# EAGLE design extension.board.v3 (EAGLE 9.0.1)
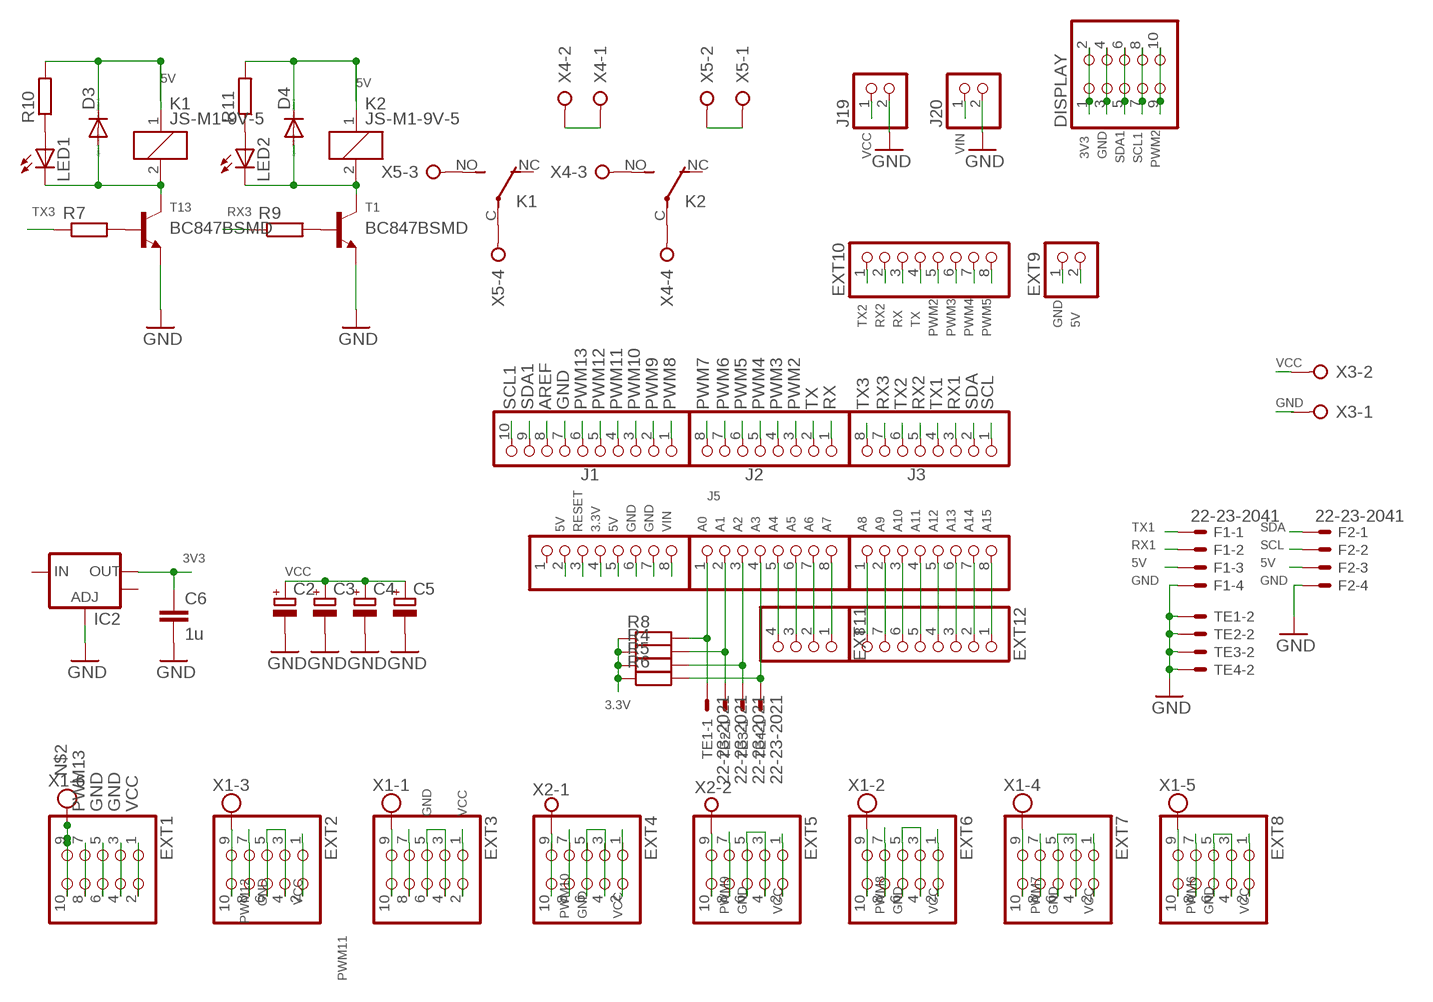
[diagram p0: schematic, sheet 1]

## Parts
C2  CPOL-EUE2.5-7  [E2,5-7]
C3  CPOL-EUE2.5-7  [E2,5-7]
C4  CPOL-EUE2.5-7  [E2,5-7]
C5  CPOL-EUE2.5-7  [E2,5-7]
C6  1u  C-EUC0805  [C0805]
D3  DIODE-DO-214AC  [DO-214AC]
D4  DIODE-DO-214AC  [DO-214AC]
DISPLAY  PINHD-2X5  [2X05]
EXT1  PINHD-2X5  [2X05]
EXT2  PINHD-2X5  [2X05]
EXT3  PINHD-2X5  [2X05]
EXT4  PINHD-2X5  [2X05]
EXT5  PINHD-2X5  [2X05]
EXT6  PINHD-2X5  [2X05]
EXT7  PINHD-2X5  [2X05]
EXT8  PINHD-2X5  [2X05]
EXT9  PINHD-1X2  [1X02]
EXT10  PINHD-1X8  [1X08]
EXT11  PINHD-1X4  [1X04]
EXT12  PINHD-1X8  [1X08]
F1  22-23-2041  [22-23-2041]
F2  22-23-2041  [22-23-2041]
IC2  V_REG_LM1117SOT223  [SOT223]
J1  PINHD-1X10  [1X10]
J2  PINHD-1X8  [1X08]
J3  PINHD-1X8  [1X08]
J4  PINHD-1X8  [1X08]
J5  PINHD-1X8  [1X08]
J6  PINHD-1X8  [1X08]
J19  PINHD-1X2  [1X02]
J20  PINHD-1X2  [1X02]
K1  JS-M1-9V-5  [JS-M]
K2  JS-M1-9V-5  [JS-M]
LED1  LEDSML1206  [SML1206]
LED2  LEDSML1206  [SML1206]
R4  R-EU_R1206  [R1206]
R5  R-EU_R1206  [R1206]
R6  R-EU_R1206  [R1206]
R7  R-EU_R1206  [R1206]
R8  R-EU_R1206  [R1206]
R9  R-EU_R1206  [R1206]
R10  R-EU_R1206  [R1206]
R11  R-EU_R1206  [R1206]
T1  BC847BSMD  [SOT23]
T13  BC847BSMD  [SOT23]
TE1  22-23-2021  [22-23-2021]
TE2  22-23-2021  [22-23-2021]
TE3  22-23-2021  [22-23-2021]
TE4  22-23-2021  [22-23-2021]
X1  W237-6  [W237-6]
X2  W237-02P  [W237-132]
X3  W237-02P  [W237-132]
X4  W237-04P  [W237-4P]
X5  W237-04P  [W237-4P]

## Nets
3.3V: J6.4 R4.1 R5.1 R6.1 R8.1
3V3: C6.1 DISPLAY.1 DISPLAY.2 IC2.2(OUT)
5V: D3.C D4.C EXT9.2 F1.3 F2.3 J6.2 J6.5 K1.1 K2.1 R10.2 R11.2
A0: J5.1 R8.2 TE1.1
A1: J5.2 R4.2 TE2.1
A2: J5.3 R5.2 TE3.1
A3: J5.4 R6.2 TE4.1
A4: EXT11.4 J5.5
A5: EXT11.3 J5.6
A6: EXT11.2 J5.7
A7: EXT11.1 J5.8
A8: EXT12.8 J4.1
A9: EXT12.7 J4.2
A10: EXT12.6 J4.3
A11: EXT12.5 J4.4
A12: EXT12.4 J4.5
A13: EXT12.3 J4.6
A14: EXT12.2 J4.7
A15: EXT12.1 J4.8
AREF: J1.8
GND: C2.- C3.- C4.- C5.- C6.2 DISPLAY.3 DISPLAY.4 EXT1.3 EXT1.4 EXT1.5 EXT1.6 EXT2.3 EXT2.4 EXT2.5 EXT2.6 EXT3.3 EXT3.4 EXT3.5 EXT3.6 EXT4.3 EXT4.4 EXT4.5 EXT4.6 EXT5.3 EXT5.4 EXT5.5 EXT5.6 EXT6.3 EXT6.4 EXT6.5 EXT6.6 EXT7.3 EXT7.4 EXT7.5 EXT7.6 EXT8.3 EXT8.4 EXT8.5 EXT8.6 EXT9.1 F1.4 F2.4 IC2.1(ADJ) J1.7 J6.6 J6.7 J19.2 J20.2 T1.2(E) T13.2(E) TE1.2 TE2.2 TE3.2 TE4.2 X3.1
N$2: EXT1.9 EXT1.10 X1.6
N$3: EXT8.9 EXT8.10 X1.5
N$4: EXT7.9 EXT7.10 X1.4
N$5: EXT2.9 EXT2.10 X1.3
N$6: EXT6.9 EXT6.10 X1.2
N$7: EXT3.9 EXT3.10 X1.1
N$8: EXT5.9 EXT5.10 X2.2
N$9: EXT4.9 EXT4.10 X2.1
N$10: R7.2 T13.1(B)
N$11: D4.A K2.2 LED2.C T1.3(C)
N$12: R9.2 T1.1(B)
N$13: X4.1 X4.2
N$14: X5.1 X5.2
N$15: K2.C(2:P) X4.4
N$16: K1.C(2:P) X5.4
N$17: K2.NO(2:S) X4.3
N$18: K1.NO(2:S) X5.3
N$19: LED1.A R10.1
N$20: LED2.A R11.1
N$41: D3.A K1.2 LED1.C T13.3(C)
PWM2: DISPLAY.9 DISPLAY.10 EXT10.5 J2.3
PWM3: EXT10.6 J2.4
PWM4: EXT10.7 J2.5
PWM5: EXT10.8 J2.6
PWM6: EXT8.7 EXT8.8 J2.7
PWM7: EXT7.7 EXT7.8 J2.8
PWM8: EXT6.7 EXT6.8 J1.1
PWM9: EXT5.7 EXT5.8 J1.2
PWM10: EXT4.7 EXT4.8 J1.3
PWM11: EXT3.7 EXT3.8 J1.4
PWM12: EXT2.7 EXT2.8 J1.5
PWM13: EXT1.7 EXT1.8 J1.6
RESET: J6.3
RX: EXT10.3 J2.1
RX1: F1.2 J3.3
RX2: EXT10.2 J3.5
RX3: J3.7 R9.1
SCL: F2.2 J3.1
SCL1: DISPLAY.7 DISPLAY.8 J1.10
SDA: F2.1 J3.2
SDA1: DISPLAY.5 DISPLAY.6 J1.9
TX: EXT10.4 J2.2
TX1: F1.1 J3.4
TX2: EXT10.1 J3.6
TX3: J3.8 R7.1
VCC: C2.+ C3.+ C4.+ C5.+ EXT1.1 EXT1.2 EXT2.1 EXT2.2 EXT3.1 EXT3.2 EXT4.1 EXT4.2 EXT5.1 EXT5.2 EXT6.1 EXT6.2 EXT7.1 EXT7.2 EXT8.1 EXT8.2 J19.1 X3.2
VIN: J6.8 J20.1
Unconnected: IC2.3(IN) IC2.4(OUT) J6.1 K1.NC(2:O) K2.NC(2:O)

## Library data of the parts
C2-C5 = rcl:CPOL-EU: POLARIZED CAPACITOR, European symbol; SPICEPREFIX: C
C6 = rcl:C-EU: CAPACITOR, European symbol
D3 D4 = diode:DIODE-: DIODE
DISPLAY EXT1-EXT8 = pinhead:PINHD-2X5: PIN HEADER
EXT9 J19 J20 = pinhead:PINHD-1X2: PIN HEADER
EXT10 EXT12 J2-J6 = pinhead:PINHD-1X8: PIN HEADER
EXT11 = pinhead:PINHD-1X4: PIN HEADER
F1 F2 = con-molex:22-23-2041: .100" (2.54mm) Center Header - 4 Pin; MF: MOLEX; MPN: 22-23-2041; OC_FARNELL: 1462920; OC_NEWARK: 38C0355
IC2 = sparkfun:V_REG_LM1117: Voltage Regulator LM1117 Standard adjustable voltage regulator but in SMD form. Spark Fun Electronics SKU : COM-00595
J1 = pinhead:PINHD-1X10: PIN HEADER
K1 K2 = relay:JS-M1*: Automotive Ultra-Miniature Power Relay NAiS Source: http://www.mew-europe.com/.. en_ds_61211_0000.pdf; OC_FARNELL: unknown; OC_NEWARK: unknown
LED1 LED2 = led:LED: LED OSRAM: - CHIPLED LG R971, LG N971, LY N971, LG Q971, LY Q971, LO R971, LY R971 LH N974, LH R974 LS Q976, LO Q976, LY Q976 LO Q996 - Hyper CHIPLED LW Q18S LB Q993, LB Q99A, LB R99A - SideLED LS A670, LO A670, LY A670, LG A670, LP A670 LB A673, LV A673, LT A673, LW A673 LH A674 LY A675 LS A676, LA A676, LO A676, LY A676, LW A676 LS A679, LY A679, LG A679 - Hyper Micro SIDELED® LS Y876, LA Y876, LO Y876, LY Y876 LT Y87S - SmartLED LW L88C, LW L88S LB L89C, LB L89S, LG L890 LS L89K, LO L89K, LY L89K LS L896, LA L896, LO L896, LY L896 - TOPLED LS T670, LO T670, LY T670, LG T670, LP T670 LSG T670, LSP T670, LSY T670, LOP T670, LYG T670 LG T671, LOG T671, LSG T671 LB T673, LV T673, LT T673, LW T673 LH T674 LS T676, LA T676, LO T676, LY T676, LB T676, LH T676, LSB T676, LW T676 LB T67C, LV T67C, LT T67C, LS T67K, LO T67K, LY T67K, LW E67C LS E67B, LA E67B, LO E67B, LY E67B, LB E67C, LV E67C, LT E67C LW T67C LS T679, LY T679, LG T679 LS T770, LO T770, LY T770, LG T770, LP T770 LB T773, LV T773, LT T773, LW T773 LH T774 LS E675, LA E675, LY E675, LS T675 LS T776, LA T776, LO T776, LY T776, LB T776 LHGB T686 LT T68C, LB T68C - Hyper Mini TOPLED® LB M676 - Mini TOPLED Santana® LG M470 LS M47K, LO M47K, LY M47K Source: http://www.osram.convergy.de LUXEON: - LUMILED® LXK2-PW12-R00, LXK2-PW12-S00, LXK2-PW14-U00, LXK2-PW14-V00 LXK2-PM12-R00, LXK2-PM12-S00, LXK2-PM14-U00 LXK2-PE12-Q00, LXK2-PE12-R00, LXK2-PE12-S00, LXK2-PE14-T00, LXK2-PE14-U00 LXK2-PB12-K00, LXK2-PB12-L00, LXK2-PB12-M00, LXK2-PB14-N00, LXK2-PB14-P00, LXK2-PB14-Q00 LXK2-PR12-L00, LXK2-PR12-M00, LXK2-PR14-Q00, LXK2-PR14-R00 LXK2-PD12-Q00, LXK2-PD12-R00, LXK2-PD12-S00 LXK2-PH12-R00, LXK2-PH12-S00 LXK2-PL12-P00, LXK2-PL12-Q00, LXK2-PL12-R00 Source: www.luxeon.com KINGBRIGHT: KA-3528ASYC Source: www.kingbright.com
R4-R11 = rcl:R-EU_: RESISTOR, European symbol; SPICEPREFIX: R
T1 T13 = transistor-npn:BC847*: NPN Transistor
TE1-TE4 = con-molex:22-23-2021: .100" (2.54mm) Center Header - 2 Pin; MF: MOLEX; MPN: 22-23-2021; OC_FARNELL: 1462926; OC_NEWARK: 25C3832; SPICEPREFIX: X
X1 = con-wago-500:W237-6: WAGO SCREW CLAMP; OC_FARNELL: unknown; OC_NEWARK: unknown
X2 X3 = con-wago-508:W237-02P: WAGO SREW CLAMP; OC_FARNELL: unknown; OC_NEWARK: unknown
X4 X5 = con-wago-508:W237-04P: WAGO SREW CLAMP; OC_FARNELL: unknown; OC_NEWARK: unknown

## Net classes
0 default: width 0.406 mm, drill 0.406 mm, clearance 0.406 mm
3 power usb: width 0.508 mm, drill 0.406 mm, clearance 0.203 mm

## Board
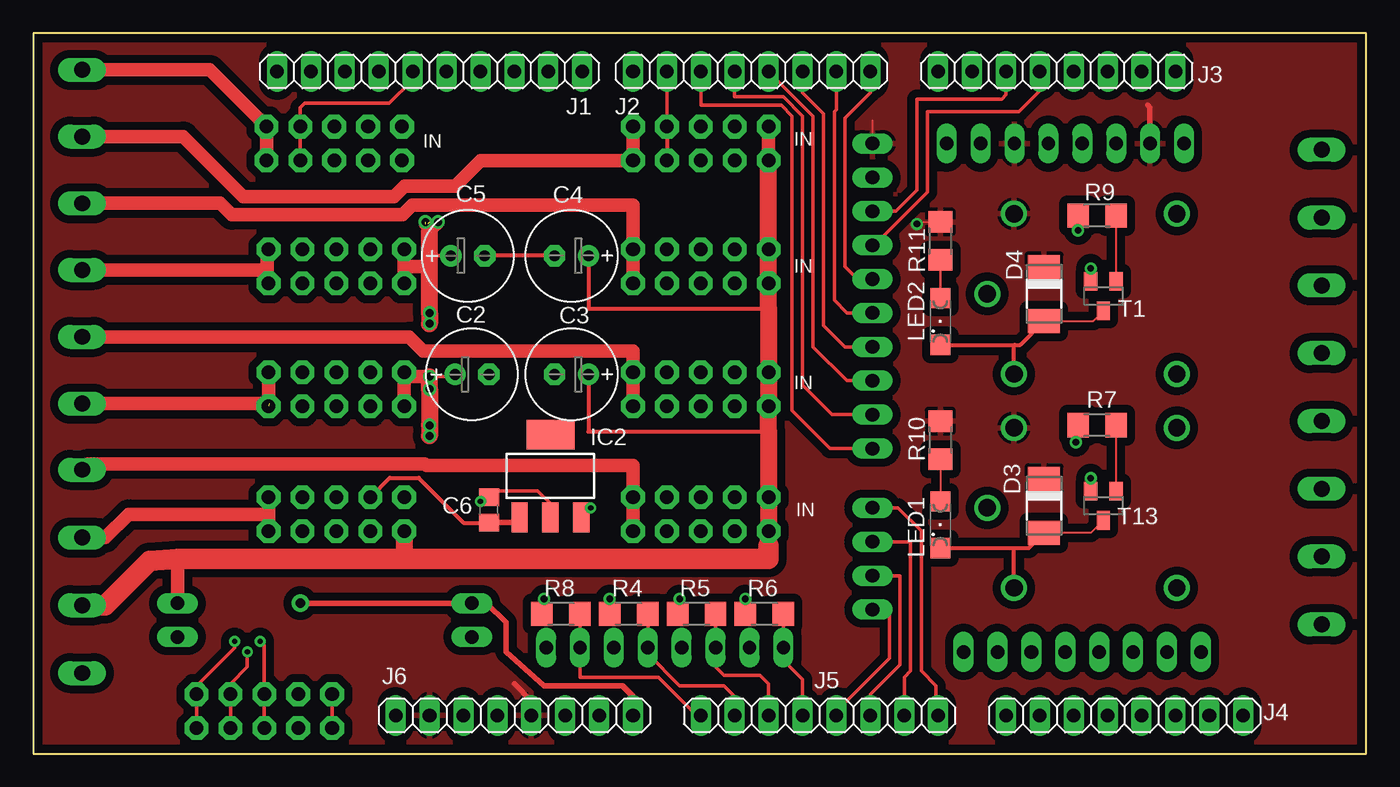
[diagram p1: board, top side]
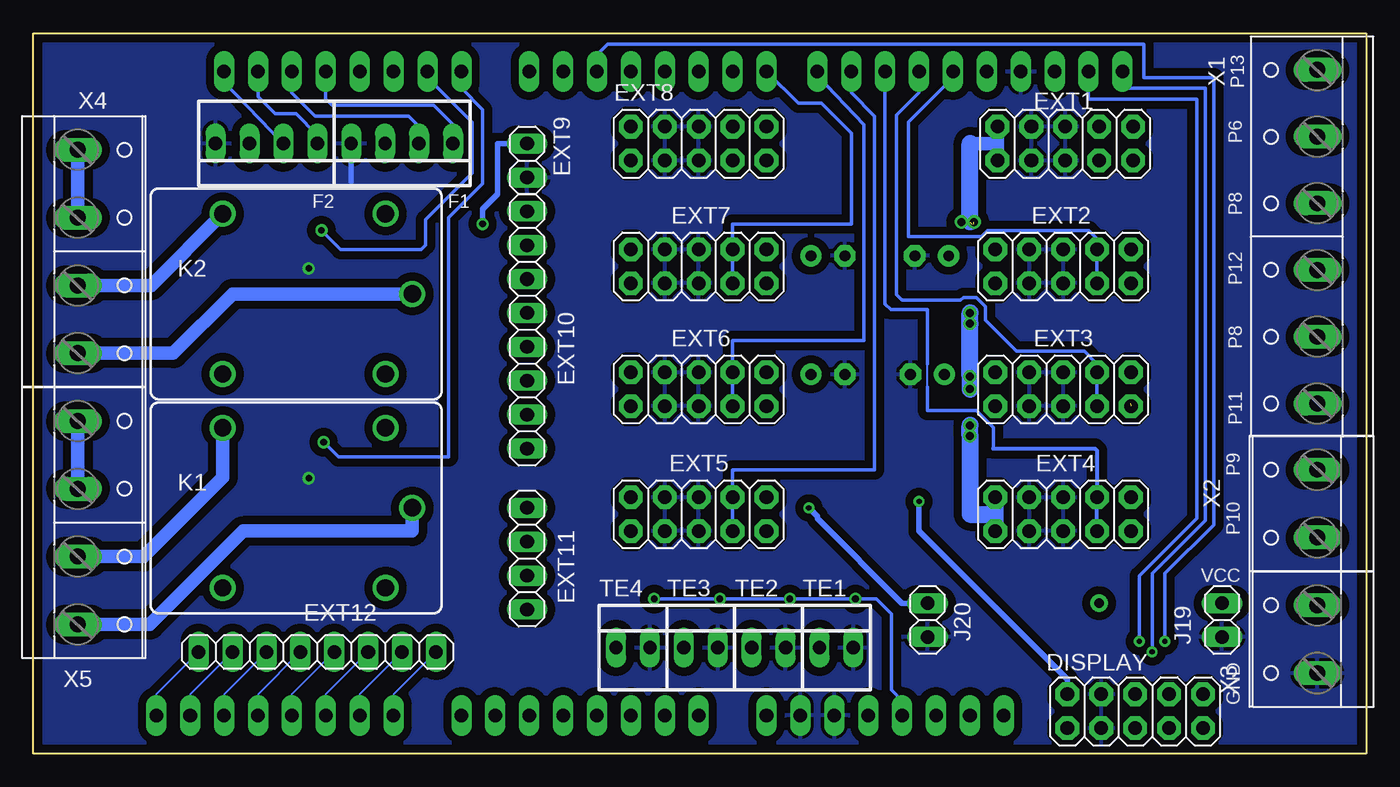
[diagram p2: board, bottom side, seen from below]

Size 99.85 x 53.98 mm. Coordinates in mm from the lower left corner, seen from the top.
Outline: 0,53.98 0,0 99.85,0 99.85,53.98 0,53.98
Copper layers (1*16): Top 0.035mm / dielectric 1.5mm / Bottom 0.035mm
Design rules "default *": minimum track width 4mil, minimum drill 0.35mm, track to track 4mil, track to pad 4mil, pad to pad 4mil, via to via 4mil, smd to smd 6mil, copper to edge 15mil, drill to drill 6mil, minimum pad ring 10mil, minimum via ring 8mil, stop-mask expansion 4mil, vias tented up to drill 0mil, thermal gap 10mil

### Footprints (pad centres in the part's own frame; a part is rotated, then mirrored left to right if it is on the bottom)
E2,5-7 = drill 0.813 pad 1.6: + -1.27,0 | drill 0.813 pad 1.6 octagon: - 1.27,0
C0805 = smd 1.3 x 1.5: 1 -0.95,0; 2 0.95,0
DO-214AC = smd 1.8 x 2.4: A 2.025,0; C -2.025,0
2X05 = drill 1.016 pad 1.778 octagon: 1 -5.08,-1.27; 2 -5.08,1.27; 3 -2.54,-1.27; 4 -2.54,1.27; 5 0,-1.27; 6 0,1.27; 7 2.54,-1.27; 8 2.54,1.27; 9 5.08,-1.27; 10 5.08,1.27
1X02 = drill 1.016 long: 1 -1.27,0; 2 1.27,0
1X08 = drill 1.016 long: 1 -8.89,0; 2 -6.35,0; 3 -3.81,0; 4 -1.27,0; 5 1.27,0; 6 3.81,0; 7 6.35,0; 8 8.89,0
1X04 = drill 1.016 long: 1 -3.81,0; 2 -1.27,0; 3 1.27,0; 4 3.81,0
22-23-2041 = drill 1 long: 1 -3.81,0; 2 -1.27,0; 3 1.27,0; 4 3.81,0
SOT223 = smd 1.219 x 2.235: 1 -2.311,-3.099; 2 0,-3.099; 3 2.311,-3.099 | smd 3.6 x 2.2: 4 0,3.099
1X10 = drill 1.016 long: 1 -11.43,0; 2 -8.89,0; 3 -6.35,0; 4 -3.81,0; 5 -1.27,0; 6 1.27,0; 7 3.81,0; 8 6.35,0; 9 8.89,0; 10 11.43,0
JS-M = drill 1.3: 1 6.7,6; 2 6.7,-6; C 8.7,0; NC -5.5,-6; NO -5.5,6
SML1206 = smd 1.5 x 1.5: A 1.75,0; C -1.75,0
R1206 = smd 1.6 x 1.803: 1 -1.422,0; 2 1.422,0
SOT23 = smd 1 x 1.4: 1 -0.95,-1.1; 2 0.95,-1.1; 3 0,1.1
22-23-2021 = drill 1 long: 1 -1.27,0; 2 1.27,0
W237-6 = drill 1.194 long: 1 -12.5,-1.27; 2 -7.5,-1.27; 3 -2.5,-1.27; 4 2.5,-1.27; 5 7.5,-1.27; 6 12.5,-1.27
W237-132 = drill 1.194 long: 1 -2.54,-0.635; 2 2.54,-0.635
W237-4P = drill 1.194 long: 1 -7.62,-0.635; 2 -2.54,-0.635; 3 2.54,-0.635; 4 7.62,-0.635

### Placement (x,y rotation side)
C2  40.32,28.42 180 top
C3  32.86,28.42 0 top
C4  32.54,37.31 0 top
C5  40.32,37.31 180 top
C6  34.13,18.26 270 top
D3  75.72,18.57 270 top
D4  75.72,34.45 270 top
DISPLAY  17.3,3.17 0 bottom
EXT1  22.54,45.72 0 bottom
EXT2  22.7,36.51 0 bottom
EXT3  22.7,27.3 0 bottom
EXT4  22.7,17.94 0 bottom
EXT5  50.01,17.94 0 bottom
EXT6  50.01,27.3 0 bottom
EXT7  50.01,36.51 0 bottom
EXT8  50.01,45.72 0 bottom
EXT9  62.87,44.45 90 bottom
EXT10  62.87,31.75 270 bottom
EXT11  62.87,14.61 270 bottom
EXT12  78.58,7.62 0 bottom
F1  72.23,45.72 180 bottom
F2  82.39,45.72 180 bottom
IC2  38.73,20.8 0 top
J1  29.69,51.12 180 top
J2  53.82,51.12 180 top
J3  76.68,51.12 180 top
J4  81.76,2.86 0 top
J5  58.9,2.86 0 top
J6  36.04,2.86 0 top
J19  10.79,10 270 bottom
J20  32.86,10 270 bottom
K1  80.17,18.41 0 bottom
K2  80.17,34.45 0 bottom
LED1  67.94,17.14 90 top
LED2  67.94,32.38 90 top
R4  44.61,10.48 0 top
R5  49.69,10.48 0 top
R6  54.77,10.48 0 top
R7  79.69,24.61 0 top
R8  39.53,10.48 0 top
R9  79.69,40.32 0 top
R10  67.94,23.5 90 top
R11  67.94,38.42 90 top
T1  80.17,34.29 180 top
T13  80.17,18.57 180 top
TE1  39.69,7.94 0 bottom
TE2  44.77,7.94 0 bottom
TE3  49.85,7.94 0 bottom
TE4  54.93,7.94 0 bottom
X1  4.92,38.73 90 bottom
X2  4.29,18.73 90 bottom
X3  4.29,8.57 90 bottom
X4  95.89,37.62 270 bottom
X5  95.89,17.3 270 bottom

### Tracks (layer width: path | path; a pad name or v marks a point on that pad's centre or on a via)
3.3V  (via drill 0.5)
  Top 0.254: v38.26,11.59 38.26,10.63 R8.1 | v43.18,11.59 R4.1 | v48.42,11.59 48.42,10.63 R5.1 | v53.34,11.59 R6.1
  Bottom 0.254: v53.34,11.59 v48.42,11.59 v43.18,11.59 v38.26,11.59 36.67,11.59 35.56,10.48 35.56,4.76 34.77,3.97 J6.4
3V3  (via drill 0.4)
  Top 0.254: IC2.2 38.73,18.73 37.78,19.68 34.13,19.68 C6.1 33.81,19.21 v33.5,18.89 | DISPLAY.1 DISPLAY.2
  Bottom 0.406: v33.5,18.89 33.5,16.67 22.38,5.56 DISPLAY.2
5V  (via drill 0.5)
  Top 0.127: EXT9.2 62.87,47.47 | R11.2 66.36,39.84 66.36,39.85 v66.2,39.69
  Top 0.406: 83.5,48.58 83.66,48.42 F2.3 | J6.5 37.31,3.97 36.04,5.24
  Bottom 0.406: v66.2,39.69 66.2,40.8 65.09,41.91 65.09,45.72 EXT9.2
  pour Top (isolate 0.61): 0,53.98 99.85,53.98 99.85,0 0,0
A0
  Top 0.152: 40.95,9.05 TE1.1
  Top 0.254: J5.1 49.69,2.86 46.83,5.71 40.96,5.71 TE1.1 R8.2
A1
  Top 0.152: 46.03,9.05 TE2.1
  Top 0.254: R4.2 TE2.1 46.04,7.46 48.42,5.08 51.75,5.08 52.55,4.29 J5.2
A2
  Top 0.254: J5.3 55.09,5.24 54.45,5.87 51.75,5.87 51.12,6.51 TE3.1 R5.2
A3
  Top 0.254: J5.4 57.63,5.56 56.2,6.99 TE4.1 R6.2
A4
  Top 0.254: EXT11.4 64.14,10.79 64.14,7.14 60.17,3.17 J5.5
A5
  Top 0.254: EXT11.3 64.93,13.34 64.93,6.67 62.71,4.45 J5.6
A6
  Top 0.254: EXT11.2 65.72,15.88 65.72,6.19 65.25,5.71 J5.7
A7
  Top 0.127: 67.63,3.02 J5.8
  Top 0.254: EXT11.1 64.77,18.41 66.52,16.67 66.52,6.19 67.63,5.08 67.63,3.02
A8
  Bottom 0.127: EXT12.8 72.87,4.45 J4.1
A9
  Bottom 0.127: EXT12.7 75.41,4.45 J4.2
A10
  Bottom 0.127: EXT12.6 77.95,4.45 J4.3
A11
  Bottom 0.127: EXT12.5 80.49,4.45 J4.4
A12
  Bottom 0.127: EXT12.4 83.03,4.45 J4.5
A13
  Bottom 0.127: EXT12.3 85.57,4.45 J4.6
A14
  Bottom 0.127: EXT12.2 88.11,4.45 J4.7
A15
  Bottom 0.127: EXT12.1 90.65,4.45 J4.8
GND  (via drill 0.5)
  Top 0.152: T13.2 79.22,20.15 v79.22,20.64 | T1.2 v79.22,36.35
  Top 0.305: C5.- C4.- | EXT4.4 25.26,19.21 26.7,20.66 28.87,20.66 32.23,17.3 C6.2
  Top 0.406: C6.2 36.03,17.31 IC2.1
  Bottom 0.406: F1.4 76.04,42.86
  pour Bottom (isolate 0.61): 0,53.98 99.85,53.98 99.85,0 0,0
N$2
  Top 1.016: X1.6 13.22,51.23 EXT1.10 EXT1.9
N$3
  Top 1.016: X1.5 11.23,46.23 15.72,41.75 27.02,41.75 27.8,42.54 31.59,42.54 33.5,44.45 EXT8.9 EXT8.10
N$4
  Top 1.016: X1.4 14.01,41.23 14.87,40.38 27.66,40.38 28.39,41.12 44.93,41.12 EXT7.10 EXT7.9
N$5
  Top 1.016: 17.5,36.23 X1.3 | EXT2.10 17.5,37.66 17.5,36.23 | EXT2.9 17.5,35.36 17.5,36.23
N$6
  Top 1.016: X1.2 28.14,31.23 29.21,30.16 44.93,30.16 EXT6.10 EXT6.9
N$7  (1 unrouted)
  Top 1.016: X1.1 17.66,26.23 | EXT3.9 EXT3.10
N$8
  Top 1.016: X2.2 4.1,21.72 29.32,21.72 29.45,21.59 44.93,21.59 EXT5.10 EXT5.9
N$9
  Top 1.016: X2.1 5.4,16.19 7.14,17.94 17.62,17.94 | 17.62,17.94 EXT4.10 | EXT4.9 17.62,17.94
N$10
  Top 0.152: R7.2 T13.1
N$11
  Top 0.152: D4.A 79.4,32.42 T1.3 | 73.47,30.6 73.5,30.64
  Top 0.305: LED2.C 73.5,30.64 73.94,30.64 D4.A | K2.2 73.47,30.6
N$12
  Top 0.152: R9.2 T1.1
N$13
  Bottom 1.016: X4.1 X4.2
N$14
  Bottom 1.016: X5.1 X5.2
N$15
  Bottom 1.016: K2.C 84.93,34.45 89.38,30 X4.4
N$16
  Bottom 1.016: K1.C 71.47,16.67 84.14,16.67 91.12,9.68 X5.4
N$17
  Bottom 1.016: K2.NO 91.03,35.08 X4.3
N$18
  Bottom 1.016: K1.NO 85.67,20.69 91.6,14.76 X5.3
N$19
  Top 0.152: R10.1 LED1.A
N$20
  Top 0.203: R11.1 LED2.A
N$41
  Top 0.152: 73.47,15.36 73.5,15.39 | T13.3 79.24,16.55 D3.A
  Top 0.305: LED1.C 73.5,15.39 74.57,15.39 D3.A | K1.2 73.47,15.36
PWM2  (via drill 0.4)
  Top 0.254: J2.3 57.63,49.53 59.21,47.94 59.21,32.07 60.8,30.48 EXT10.5 | v15.08,8.41 15.08,7.94 12.22,5.08 DISPLAY.10 DISPLAY.9
  Bottom 0.254: v15.08,8.41 15.08,13.49 11.43,17.14 11.43,50.64 16.67,50.64 16.66,53.17 56.84,53.17 57.63,52.39 J2.3
PWM3
  Top 0.254: EXT10.6 60.96,27.94 58.42,30.48 58.42,47.78 J2.4
PWM4
  Top 0.254: EXT10.7 59.85,25.4 57.63,27.62 57.63,47.78 56.2,49.21 52.55,49.21 J2.5 52.55,50.48
PWM5
  Top 0.254: EXT10.8 59.69,22.86 56.83,25.72 56.83,47.78 56.04,48.58 50.01,48.58 J2.6
PWM6
  Top 0.254: J2.7 EXT8.8
  Top 0.305: EXT8.8 EXT8.7
PWM7
  Bottom 0.254: J2.8 42.55,48.74 40.8,48.74 38.58,46.51 38.58,39.69 47.47,39.69 EXT7.8 EXT7.7
PWM8
  Bottom 0.254: J1.1 41.12,50.8 37.62,47.15 37.62,30.96 47.47,30.96 EXT6.8 EXT6.7
PWM9
  Bottom 0.254: J1.2 38.58,49.53 36.83,47.78 36.83,21.27 47.47,21.27 EXT5.8 EXT5.7
PWM10
  Bottom 0.152: 32.86,27.46 32.86,29.21
  Bottom 0.254: 27.94,22.86 27.94,24.45 29.21,25.72 32.86,25.72 32.86,27.46 | J1.3 36.04,33.7 35.62,33.28 32.86,33.28 32.86,29.21
  Bottom 0.305: EXT4.7 EXT4.8 20.16,22.7 20.32,22.86 27.94,22.86
PWM11
  Bottom 0.254: J1.4 33.5,49.53 35.19,47.84 35.19,34.39 34.77,33.97 30.39,33.97 30.17,34.19 29.2,34.19 28.52,33.5 28.52,32.49 26.19,30.16 21.11,30.16 20.16,29.21 EXT3.8 EXT3.7
PWM12
  Bottom 0.254: J1.5 30.96,50.64 34.29,47.31 34.29,38.73 28.84,38.73 28.37,39.2 27.15,39.2 | 27.15,39.2 27.15,39.21 | 27.15,39.2 20.79,39.2 20.16,38.58 EXT2.8 EXT2.7
PWM13
  Top 0.254: J1.6 28.42,50.48 26.67,48.74 20.32,48.74 20,48.42 EXT1.8 EXT1.7
RX
  Top 0.254: J2.1 62.71,49.53 60.8,47.62 60.8,36.51 61.75,35.56 EXT10.3
RX1
  Bottom 0.254: J3.3 80.49,49.53 78.74,47.78 71.75,47.78 70.96,46.99 F1.2
RX2
  Top 0.152: 63.02,38.1 EXT10.2
  Top 0.254: 63.02,38.1 66.99,42.07 66.99,48.1 73.82,48.1 75.41,49.69 J3.5
RX3  (via drill 0.5)
  Top 0.152: 78.27,41.11 R9.1
  Top 0.254: v78.26,39.21 v78.27,39.22 R9.1
  Bottom 0.254: J3.7 70.33,50.64 66.99,47.31 66.99,43.5 70.48,40.01 70.48,38.1 70.8,37.78 76.83,37.78 v78.26,39.21
SCL
  Bottom 0.254: J3.1 85.57,50.32 F2.2
SCL1  (via drill 0.4)
  Top 0.254: v16.03,7.62 16.03,6.51 14.76,5.24 DISPLAY.8 DISPLAY.7
  Bottom 0.254: J1.10 18.26,49.85 12.06,49.85 12.06,17.46 16.03,13.49 v16.03,7.62
SDA
  Bottom 0.254: J3.2 83.03,49.21 81.76,47.94 80.17,47.94 78.58,46.35 F2.1
SDA1  (via drill 0.4)
  Top 0.254: v16.99,8.41 17.3,8.1 DISPLAY.6 DISPLAY.5
  Bottom 0.254: J1.9 20.8,49.05 12.7,49.05 12.7,17.62 16.99,13.34 v16.99,8.41
TX
  Top 0.254: J2.2 60.17,48.26 60.01,48.1 60.01,33.97 60.96,33.02 EXT10.4
TX1
  Bottom 0.254: J3.4 77.95,49.05 77.47,48.58 69.85,48.58 68.42,47.15 F1.1
TX2
  Top 0.254: J3.6 72.87,49.37 72.55,49.05 66.2,49.05 66.2,42.23 64.61,40.64 EXT10.1
TX3  (via drill 0.5)
  Top 0.152: v78.11,23.34 78.27,23.5 R7.1
  Bottom 0.254: J3.8 67.79,49.85 66.2,48.26 66.2,42.7 68.74,40.16 68.74,22.23 76.99,22.23 v78.11,23.34
VCC  (via drill 0.6)  (2 unrouted)
  Top 0.254: C4.+ 29.84,37.31 29.69,37.31 | C3.+ 31.43,28.26 v29.69,28.26
  Top 0.305: C2.+ 41.59,24.13 55.09,24.13 | C5.+ 41.59,33.34 55.09,33.34
  Top 1.016: J19.1 10.79,14.61 | EXT8.1 EXT8.2 | EXT2.2 27.78,36.51 | 27.78,36.51 EXT2.1 | 29.84,37.31 29.69,37.15 29.69,36.51 27.78,36.51 | 29.69,39.38 29.69,39.53 29.52,39.69 29.37,39.69 29.69,39.38 | 29.69,39.38 29.69,39.05 | v30.32,39.85 29.85,39.38 29.69,39.38 | EXT3.1 EXT3.2 28.1,28.26 v29.69,28.26
  Top 1.27: v29.69,23.81 v29.69,24.61 v29.69,27.3 v29.69,28.26 | v29.69,32.23 v29.69,33.02 29.69,36.51 29.69,37.31 29.69,39.05 | EXT8.1 EXT7.2 EXT7.1 55.09,33.34 EXT6.2 EXT6.1 55.09,24.13 EXT5.2 EXT5.1 55.09,15.56 | EXT4.1 27.78,14.76 27.62,14.61
  Top 1.524: 55.09,15.56 55.09,14.61 27.62,14.61 10.79,14.61 8.73,14.45 5.4,11.11 X3.2
  Bottom 1.016: 29.69,45.72 27.62,45.72 | 27.62,45.72 EXT1.2 | EXT1.1 27.62,45.72
  Bottom 1.27: v29.69,33.02 v29.69,32.23 v29.69,28.26 v29.69,27.3 | v29.69,24.61 v29.69,23.81 29.69,17.94 27.78,17.94 | 29.69,39.85 29.69,45.72 | 27.78,17.94 EXT4.2 | EXT4.1 27.78,17.94
  other vias: 29.37,39.85
VIN  (via drill 0.4, 0.7 pad 1.3)
  Top 0.406: v20,11.27 J20.1 33.95,11.27 35.4,9.82 35.4,7.62 38.26,5.08 44.13,5.08 44.93,4.29 J6.8 | v41.75,18.41 41.05,17.71
  Bottom 0.406: J20.1 34.77,11.27 41.12,17.62 41.12,17.78 v41.75,18.41

### Text on the board
tPlace: IN | IN | IN | IN | IN
bPlace: P13 | P6 | P8 | P12 | P8 | P11 | P9 | P10 | VCC | GND